# EAGLE design ASM2001 (EAGLE 6.3)
DATABASE: ./../../../../../Components/TinyCircuits_Part_Database.txt
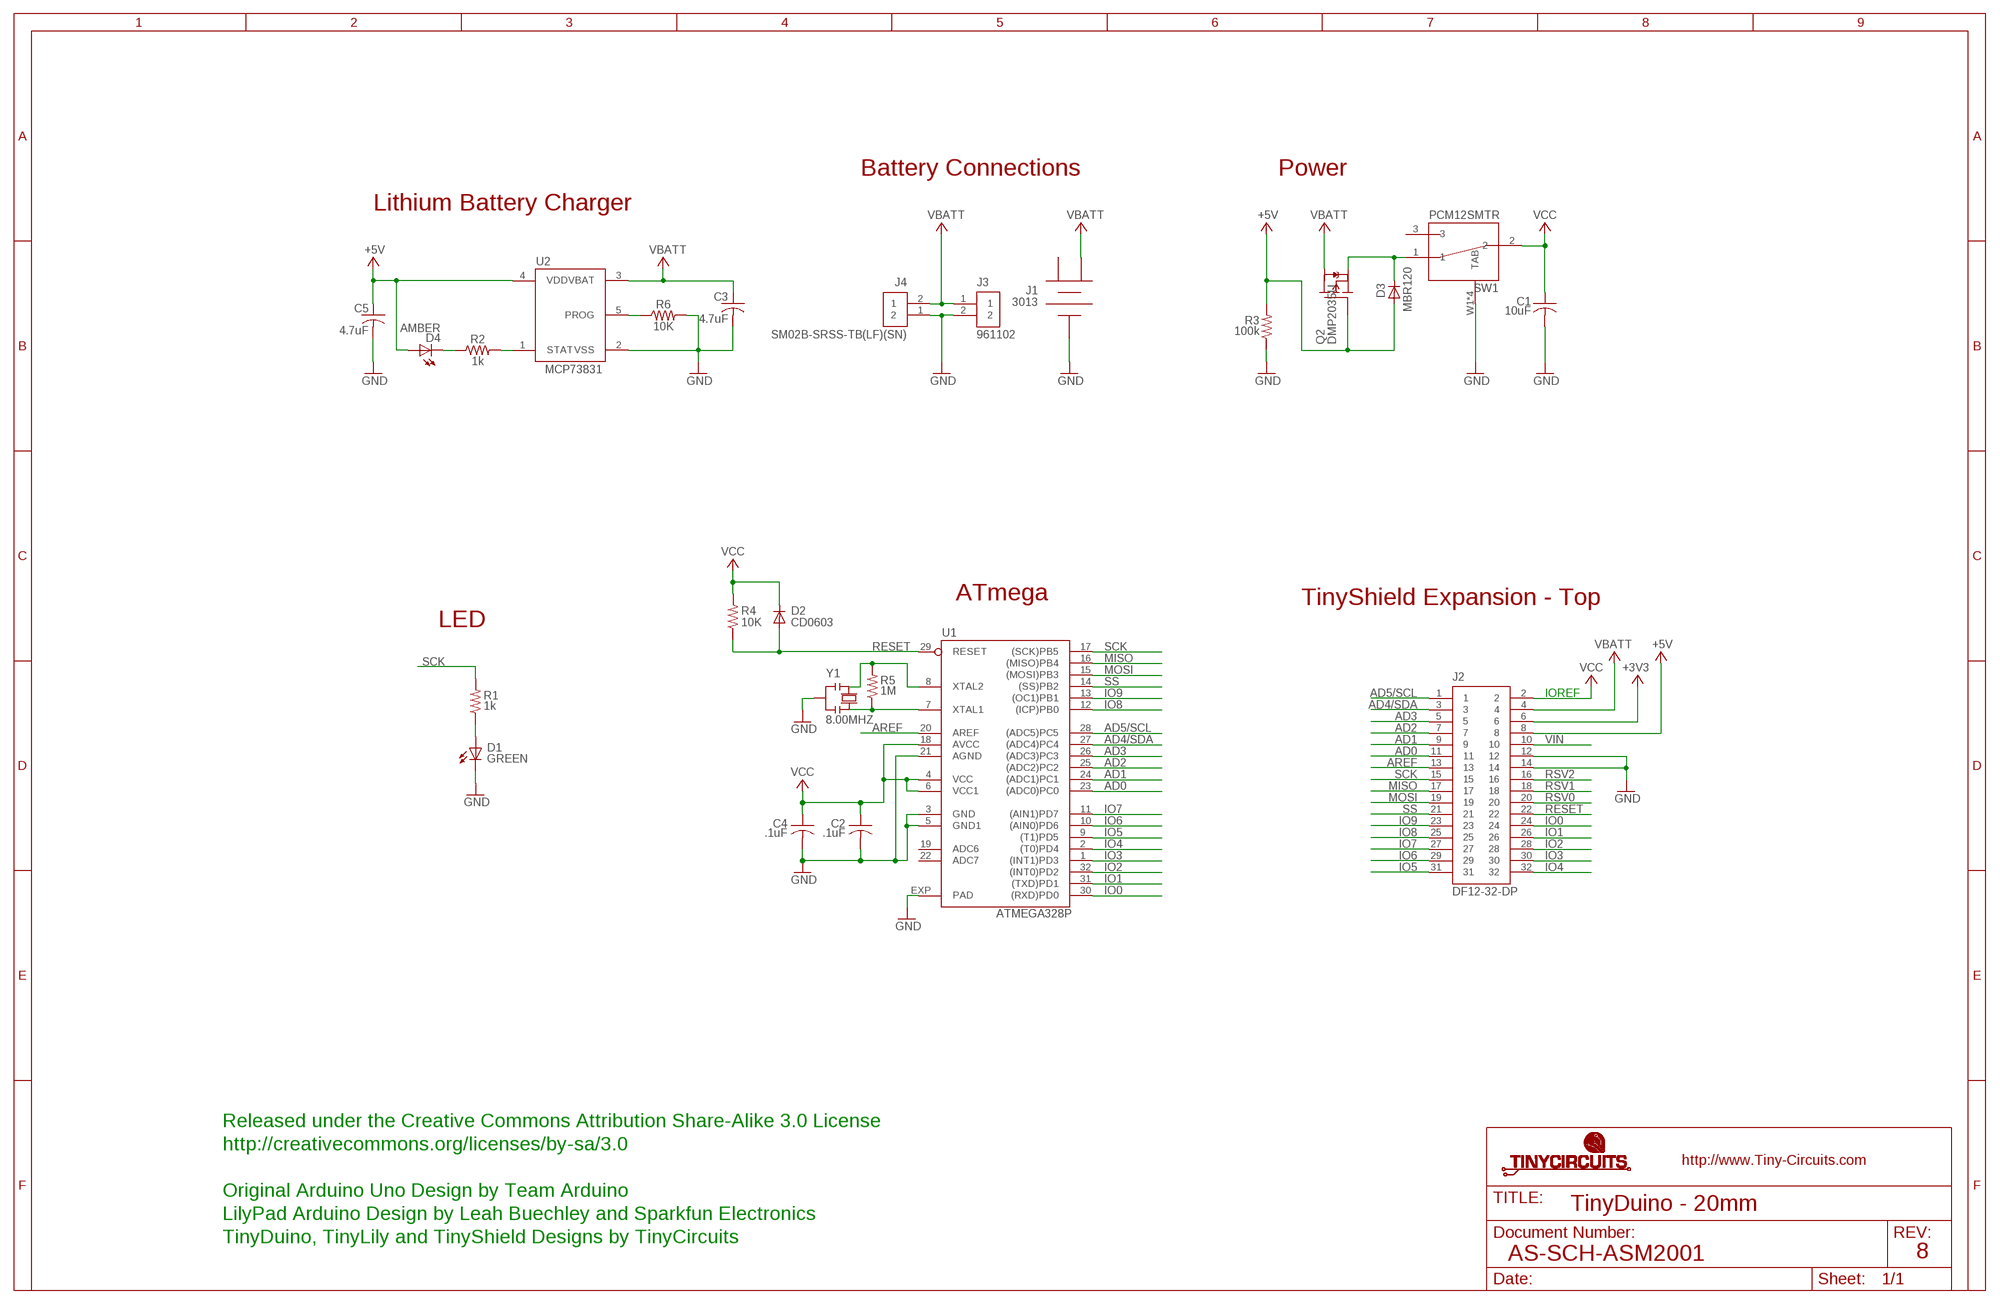
[diagram p0: schematic, sheet 1]

## Parts
C1  10uF  AS-ITM-00002  [C0603]
C2  .1uF  AS-ITM-00008  [C0402]
C3  4.7uF  AS-ITM-00242  [C0402]
C4  .1uF  AS-ITM-00008  [C0402]
C5  4.7uF  AS-ITM-00242  [C0402]
D1  GREEN  AS-ITM-00011  [LNJ_LED]
D2  CD0603  AS-ITM-00009  [0603]
D3  MBR120  AS-ITM-00111  [SOD-123FL]
D4  AMBER  AS-ITM-00026  [LNJ_LED]
J1  3013  AS-ITM-00001  [3013]
J2  DF12-32-DP  AS-ITM-00015  [DF12-32-DP]
J3  961102  AS-ITM-00044  [2X.1"]
J4  SM02B-SRSS-TB(LF)(SN)  AS-ITM-00231  [JST_SH_2X1]
Q2  DMP2035U  AS-ITM-00024  [SOT23]
R1  1k  AS-ITM-00003  [0402]
R2  1k  AS-ITM-00003  [0402]
R3  100k  AS-ITM-00004  [0402]
R4  10K  AS-ITM-00032  [0402]
R5  1M  AS-ITM-00005  [0402]
R6  10K  AS-ITM-00032  [0402]
SW1  PCM12SMTR  AS-ITM-00220  [PCM12SMTR]
U1  ATMEGA328P  AS-ITM-00013MU  [ATMEL_QFN32]
U2  MCP73831  AS-ITM-00136  [SOT-23]
Y1  8.00MHZ  AS-ITM-00027B  [RESONATOR_SMALL]

## Nets
+3V3: J2.6
+5V: C5.1 D3.A D4.A J2.8 Q2.B(G) R3.2 U2.4(VDD)
AD0: J2.11 U1.23((ADC0)PC0)
AD1: J2.9 U1.24((ADC1)PC1)
AD2: J2.7 U1.25((ADC2)PC2)
AD3: J2.5 U1.26((ADC3)PC3)
AD4/SDA: J2.3 U1.27((ADC4)PC4)
AD5/SCL: J2.1 U1.28((ADC5)PC5)
AREF: J2.13 U1.20(AREF)
GND: C1.2 C2.2 C3.2 C4.2 C5.2 D1.C J1.3 J2.12 J2.14 J3.2 J4.1 R3.1 R6.2 SW1.W1(TAB) SW1.W2(TAB) SW1.W3(TAB) SW1.W4(TAB) U1.3(GND) U1.5(GND1) U1.21(AGND) U1.EXP(PAD) U2.2(VSS) Y1.2
IO0: J2.24 U1.30((RXD)PD0)
IO1: J2.26 U1.31((TXD)PD1)
IO2: J2.28 U1.32((INT0)PD2)
IO3: J2.30 U1.1((INT1)PD3)
IO4: J2.32 U1.2((T0)PD4)
IO5: J2.31 U1.9((T1)PD5)
IO6: J2.29 U1.10((AIN0)PD6)
IO7: J2.27 U1.11((AIN1)PD7)
IO8: J2.25 U1.12((ICP)PB0)
IO9: J2.23 U1.13((OC1)PB1)
MISO: J2.17 U1.16((MISO)PB4)
MOSI: J2.19 U1.15((MOSI)PB3)
N$1: R5.2 U1.8(XTAL2) Y1.1
N$2: D3.C Q2.E(S) SW1.1
N$3: R5.1 U1.7(XTAL1) Y1.3
N$4: D1.A R1.1
N$5: D4.C R2.1
N$6: R6.1 U2.5(PROG)
N$7: R2.2 U2.1(STAT)
RESET: D2.A J2.22 R4.1 U1.29(RESET)
RSV0: J2.20
RSV1: J2.18
RSV2: J2.16
SCK: J2.15 R1.2 U1.17((SCK)PB5)
SS: J2.21 U1.14((SS)PB2)
VBATT: C3.1 J1.2 J2.4 J3.1 J4.2 Q2.C(D) U2.3(VBAT)
VCC: C1.1 C2.1 C4.1 D2.C J2.2 R4.2 SW1.2 U1.4(VCC) U1.6(VCC1) U1.18(AVCC)
VIN: J2.10
Unconnected: SW1.3 U1.19(ADC6) U1.22(ADC7)

## Notes on the sheet
- Battery Connections | Power
- Lithium Battery Charger
- ATmega | TinyShield Expansion - Top
- LED
- IOREF
- Released under the Creative Commons Attribution Share-Alike 3.0 License
- http://creativecommons.org/licenses/by-sa/3.0
- Original Arduino Uno Design by Team Arduino
- TinyDuino - 20mm
- LilyPad Arduino Design by Leah Buechley and Sparkfun Electronics
- TinyDuino, TinyLily and TinyShield Designs by TinyCircuits
- AS-SCH-ASM2001 | 8

## Power pins joined to a net without a drawn wire
1: J1.1

## Library data of the parts
C1 = tinycircuits:AS-ITM-00002: CAP CER 10UF 10V 20% X5R 0603; PARTNO: AS-ITM-00002
C2 C4 = tinycircuits:AS-ITM-00008: CAP CER 0.1UF 16V 10% X5R 0402; PARTNO: AS-ITM-00008; VALUE: 0.1uF
C3 C5 = tinycircuits:AS-ITM-00242: CAP CER 4.7UF 6.3V 20% X5R 0402; PARTNO: AS-ITM-00242
D1 = tinycircuits:AS-ITM-00011: LED GREEN SIDE VIEW SMD; PARTNO: AS-ITM-00011
D2 = tinycircuits:AS-ITM-00009: Diodes (General Purpose, Power, Switching) IO=150mA VR=75V HIGH SPEED; PARTNO: AS-ITM-00009
D3 = tinycircuits:AS-ITM-00111: DIODE SCHOTTKY 20V 1A SOD123L; PARTNO: AS-ITM-00111; VALUE: MBR120VLSFT1G
D4 = tinycircuits:AS-ITM-00026: LED AMBER SIDE VIEW SMD; PARTNO: AS-ITM-00026
J1 = tinycircuits:AS-ITM-00001: Keystone 3013 - RETAINER COIN CELL 16MM PC T/H; PARTNO: AS-ITM-00001
J2 = tinycircuits:AS-ITM-00015: CONN HEADER 32POS 3MM SMD 0.5MM; PARTNO: AS-ITM-00015
J3 = tinycircuits:AS-ITM-00044: CONN HEADER R/A SGL 2POS GOLD; PARTNO: AS-ITM-00044
J4 = tinycircuits:AS-ITM-00231: CONN HEADER SH 2POS SIDE 1MM; PARTNO: AS-ITM-00231
Q2 = tinycircuits:AS-ITM-00024: P-Channel MOSFET SOT-23; PARTNO: AS-ITM-00024
R1 R2 = tinycircuits:AS-ITM-00003: RES 1.00K OHM 1/16W 1% 0402; PARTNO: AS-ITM-00003; VALUE: 1.00K
R3 = tinycircuits:AS-ITM-00004: RES 100K OHM 1/16W 1% 0402; PARTNO: AS-ITM-00004; VALUE: 100K
R4 R6 = tinycircuits:AS-ITM-00032: RES 10.0K OHM 1/16W 1% 0402 SMD; PARTNO: AS-ITM-00032; VALUE: 10.0K
R5 = tinycircuits:AS-ITM-00005: RES 1.00M OHM 1/16W 1% 0402; PARTNO: AS-ITM-00005; VALUE: 1.00M
SW1 = tinycircuits:AS-ITM-00220: SW SLIDE SP2T 6VDC 0.3A SMT; PARTNO: AS-ITM-00220
U1 = tinycircuits:AS-ITM-00013: MCU AVR 32K FLASH 32-QFN; PARTNO: AS-ITM-00013; VALUE: ATMEGA328P-MU
U2 = tinycircuits:AS-ITM-00136: IC CONTROLLER LI-ION 4.2V SOT23-5; PARTNO: AS-ITM-00136
Y1 = tinycircuits:AS-ITM-00027: CER RESONATOR 8.00MHZ SMD; PARTNO: AS-ITM-00027

## Board
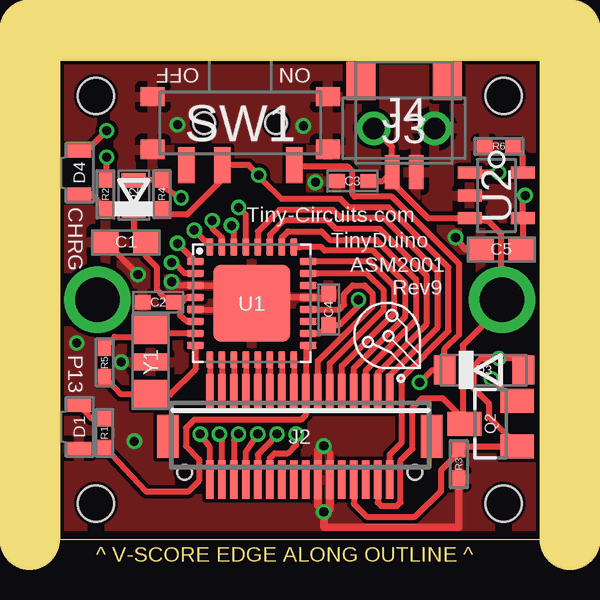
[diagram p1: board, top side]
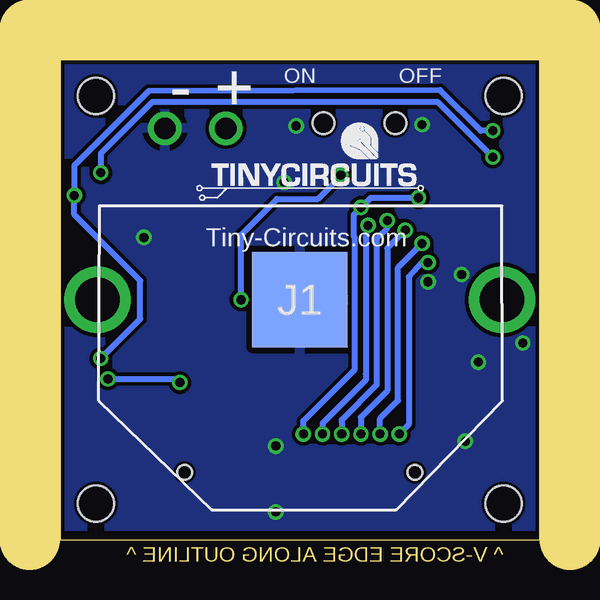
[diagram p2: board, bottom side, seen from below]

Size 20 x 20 mm. Coordinates in mm from the lower left corner, seen from the top.
Outline: 0,20 20,20 20,0 0,0 0,20
Copper layers (1*16): Top 0.035mm / dielectric 1.5mm / Bottom 0.035mm
Design rules "default *": minimum track width 8mil, minimum drill 15mil, track to track 6mil, track to pad 6mil, pad to pad 6mil, via to via 6mil, smd to smd 6mil, copper to edge 6mil, drill to drill 8mil, minimum pad ring 8mil, minimum via ring 5mil, stop-mask expansion 4mil, vias tented up to drill 25mil, thermal gap 10mil
Holes 1.5 mm at 1.5,18.5 18.5,18.5 1.5,1.5 18.5,1.5
tRestrict: 1 lines
bRestrict: 1 lines
Milling: 3 lines

### Footprints (pad centres in the part's own frame; a part is rotated, then mirrored left to right if it is on the bottom)
C0603 = smd 1.1 x 1: 1 -0.85,0; 2 0.85,0
C0402 = smd 0.65 x 0.6: 1 -0.65,0; 2 0.65,0
LNJ_LED = smd 1 x 0.55: A 0,0.9; C 0,-0.9
0603 = smd 0.61 x 0.991: A 0.622,0; C -0.622,0
SOD-123FL = smd 0.914 x 1.219: A 1.638,0; C -1.638,0
3013 = drill 1.854: 1 8.433,0; 2 -8.433,0 | smd 3.962 x 3.962: 3 0,0
DF12-32-DP = smd 0.3 x 1.6: 1 -3.75,-1.8; 2 -3.75,1.8; 3 -3.25,-1.8; 4 -3.25,1.8; 5 -2.75,-1.8; 6 -2.75,1.8; 7 -2.25,-1.8; 8 -2.25,1.8; 9 -1.75,-1.8; 10 -1.75,1.8; 11 -1.25,-1.8; 12 -1.25,1.8; 13 -0.75,-1.8; 14 -0.75,1.8; 15 -0.25,-1.8; 16 -0.25,1.8; 17 0.25,-1.8; 18 0.25,1.8; 19 0.75,-1.8; 20 0.75,1.8; 21 1.25,-1.8; 22 1.25,1.8; 23 1.75,-1.8; 24 1.75,1.8; 25 2.25,-1.8; 26 2.25,1.8; 27 2.75,-1.8; 28 2.75,1.8; 29 3.25,-1.8; 30 3.25,1.8; 31 3.75,-1.8; 32 3.75,1.8 | smd 0.9 x 1.8: F1 -5.5,0; F2 5.5,0 | hole 0.6: -4.8,1.5; 4.8,1.5
2X.1" = drill 0.889 pad 1.397: 1 -1.27,0; 2 1.27,0
JST_SH_2X1 = smd 0.6 x 1.4: 1 -0.5,2.475; 2 0.5,2.475 | smd 1.2 x 1.6: PAD1 -1.8,-1.325; PAD2 1.8,-1.325
SOT23 = smd 1 x 1.4: B -0.95,-1.1; C 0,1.1; E 0.95,-1.1
0402 = smd 0.65 x 0.55: 1 -0.6,0; 2 0.6,0
PCM12SMTR = smd 0.7 x 1.5: 1 -2.25,1.75; 2 0.75,1.75; 3 2.25,1.75 | smd 1 x 0.8: W1 -3.65,1.1; W2 -3.65,-1.1; W3 3.65,-1.1; W4 3.65,1.1 | hole 0.9: 1.5,0; -1.5,0
ATMEL_QFN32 = smd 0.711 x 0.305: 1 -2.351,1.75; 2 -2.351,1.25; 3 -2.351,0.75; 4 -2.351,0.25; 5 -2.351,-0.25; 6 -2.351,-0.75; 7 -2.351,-1.25; 8 -2.351,-1.75; 17 2.351,-1.75; 18 2.351,-1.25; 19 2.351,-0.75; 20 2.351,-0.25; 21 2.351,0.25; 22 2.351,0.75; 23 2.351,1.25; 24 2.351,1.75 | smd 0.305 x 0.711: 9 -1.75,-2.351; 10 -1.25,-2.351; 11 -0.75,-2.351; 12 -0.25,-2.351; 13 0.25,-2.351; 14 0.75,-2.351; 15 1.25,-2.351; 16 1.75,-2.351; 25 1.75,2.351; 26 1.25,2.351; 27 0.75,2.351; 28 0.25,2.351; 29 -0.25,2.351; 30 -0.75,2.351; 31 -1.25,2.351; 32 -1.75,2.351 | smd 3.2 x 3.2: EXP 0,0
SOT-23 = smd 0.5 x 1: 1 -0.95,-1.1; 2 0,-1.1; 3 0.95,-1.1; 4 0.95,1.1; 5 -0.95,1.1
RESONATOR_SMALL = smd 1.2 x 1.5: 1 -1.35,0; 3 1.35,0 | smd 0.7 x 1.5: 2 0,0

### Placement (x,y rotation side)
C1  2.75,12.4 180 top
C2  4.1,9.9 180 top
C3  12.2,14.95 180 top
C4  11.2,9.6 90 top
C5  10uF  [C0603]  18.4,12.1 180 top
D1  0.8,4.7 0 top
D2  3.08,14.35 90 top
D3  17.68,7.07 0 top
D4  0.8,15.3 0 top
J1  10,10 0 bottom
J2  10,4.3 180 top
J3  14.35,17.15 0 top
J4  14.35,17.8 180 top
Q2  17.96,4.83 90 top
R1  1.86,4.44 270 top
R2  1.9,14.4 90 top
R3  16.64,3.15 90 top
R4  4.25,14.4 270 top
R5  1.86,7.38 270 top
R6  18.3,16.4 180 top
SW1  7.52,17.37 180 top
U1  8,9.85 0 top
U2  18.2,14.35 270 top
U$1  [DOCFIELD-TINYCIRCUITS-PCB]  34,-10 0 top  (outside the outline)
Y1  3.77,7.41 90 top

### Tracks (layer width: path | path; a pad name or v marks a point on that pad's centre or on a via)
+5V  (via drill 0.38)
  Top 0.254: D3.A 19.39,7.55 v18.3,7.55 17.55,7.55 17.25,7.25 17.25,6.3 17.9,5.65 17.9,5.09 Q2.B 16.77,3.88 R3.2 | v19.4,14.35 19.3,14.25 U2.4 19.3,12.45 C5.1 | J2.8 12.25,1.5 12.8,0.95 14.81,0.95 15.9,2.04 15.9,2.9 16.64,3.64 R3.2 | 16.49,3.74 R3.2 | D4.A 1.1,16.2 v1.95,17.05
  Bottom 0.254: v18.3,7.55 16.65,9.2 16.65,10.8 19.4,13.55 v19.4,14.35 19.4,15.6 16.3,18.7 4.15,18.75 2.45,17.05 v1.95,17.05
AD0
  Top 0.254: 10.75,11.1 U1.23 12.8,11.1 13.5,10.4 13.5,9.6 11.25,7.35 J2.11
AD1
  Top 0.254: J2.9 11.75,7.25 13.95,9.45 13.95,10.55 12.9,11.6 U1.24
AD2
  Top 0.254: J2.7 12.25,7.15 14.4,9.3 14.4,10.7 13.05,12.05 11.05,12.05 10.9,12.2 10.05,12.2 U1.25
AD3
  Top 0.254: J2.5 12.75,7.05 14.85,9.15 14.85,10.85 13.2,12.5 11.25,12.5 10.9,12.85 9.5,12.85 9.25,12.6 U1.26
AD4/SDA
  Top 0.254: J2.3 13.25,6.95 15.3,9 15.3,11 13.35,12.95 11.5,12.95 11.15,13.3 9.35,13.3 8.75,12.7 U1.27
AD5/SCL
  Top 0.254: U1.28 8.25,12.85 9.15,13.75 11.4,13.75 11.75,13.4 13.5,13.4 15.75,11.15 15.75,8.85 13.75,6.85 J2.1
AREF
  Top 0.254: U1.20 11.65,9.6 11.85,9.8 11.85,10.25 12.2,10.6 12.7,10.6 13.05,10.25 13.05,9.75 10.75,7.45 J2.13
GND  (via drill 0.38)
  Top 0.254: 11.25,1.45 11.25,1.3 11.3,1.25 | U1.EXP 8,10.6 U1.3 4.8,10.6 v4.65,10.75 | U1.5 8,9.55 U1.EXP | U1.21 8.25,10.1 U1.EXP | U1.21 11.1,10.1 C4.2 11.05,10.1 U1.21 | C5.2 16.9,12.1 v16.5,12.6 | 11.25,2.05 J2.12 11.25,3.65 | v3.25,11.05 C1.2
  Top 0.305: 11.25,2.05 11.25,1.45 | 10.75,3.75 10.75,1.4 v11,1.15 | v11,1.15 11.1,1.15 11.25,1.3 | v11,1.15 11,0.51 16.64,0.51 R3.1
  Bottom 0.254: J1.3 10.25,10 U1.21
  other vias: 2.55,7.4 11,3.9 0.7,8.2 10.15,17.25 4.9,17.3 3.1,4.1 10.65,14.9
  pour Top: 0,20 20,20 20,0 0,0
  pour Bottom: 0,20 20,20 20,0 0,0
IO0  (via drill 0.38)
  Top 0.254: v9.05,4.4 8.75,4.05 8.25,3.55 J2.24 | U1.30 7.25,12.9 v7.15,13.1
  Bottom 0.254: v9.05,4.4 9.05,4.85 7.25,6.65 7.25,6.9 7.25,12.6 v7.15,13.1
IO1  (via drill 0.38)
  Top 0.254: J2.26 7.75,3.65 v8.25,4.4 | U1.31 6.75,12.6 6.35,13 v6.35,13.3
  Bottom 0.254: v8.25,4.4 8.25,4.9 8.25,4.95 8.25,5 6.8,6.45 6.8,12.55 6.35,13 v6.35,13.3
IO2  (via drill 0.38)
  Top 0.254: v7.45,4.4 7.25,4.15 J2.28 | U1.32 6.25,12.25 v5.6,12.9
  Bottom 0.254: v7.45,4.4 7.45,4.55 7.45,5.1 6.35,6.2 6.35,12.15 v5.6,12.9
IO3  (via drill 0.38)
  Top 0.254: J2.30 6.75,4.3 v6.65,4.4 | U1.1 5.45,11.8 v4.9,12.35
  Bottom 0.254: v6.65,4.4 6.65,5.05 5.9,5.8 5.9,11.35 v4.9,12.35
IO4  (via drill 0.38)
  Top 0.254: J2.32 6.25,3.85 v5.85,4.4 | U1.2 5.2,11.1 4.75,11.55 v4.65,11.55
  Bottom 0.254: v5.85,4.4 5.45,4.8 5.45,10.95 4.9,11.55 v4.65,11.55
IO5
  Top 0.254: U1.9 J2.31
IO6
  Top 0.254: U1.10 J2.29
IO7
  Top 0.254: U1.11 J2.27
IO8
  Top 0.254: U1.12 J2.25
IO9
  Top 0.254: U1.13 J2.23
MISO
  Top 0.254: U1.16 J2.17
MOSI
  Top 0.254: U1.15 J2.19
N$1
  Top 0.254: U1.8 5.65,7.1 4.6,6.05 Y1.1 2.54,6.05 R5.2
N$2  (via drill 0.38)
  Top 0.254: Q2.E 18.92,5.78 v18,6.7 | v15,6.55 15.52,7.07 D3.C 16.04,7.94 16.65,8.55 16.65,11.5 13.85,14.3 12.3,14.3 12.2,14.4 12.2,15.35 12,15.55 9.84,15.55 SW1.1
  Bottom 0.254: v18,6.7 15.15,6.7 v15,6.55
N$3
  Top 0.254: U1.7 3.93,8.6 Y1.3 3.4,8.75 3.1,8.45 2.28,8.45 R5.1
N$4
  Top 0.254: R1.1 1.33,5.04 D1.A
N$5
  Top 0.254: D4.C 1.3,14.4 R2.1
N$6
  Top 0.254: U2.5 19.3,16 R6.1
N$7  (via drill 0.38)
  Top 0.254: R2.2 1.95,15.05 v1.95,15.95 | v18.3,15.3 U2.1
  Bottom 0.254: v1.95,15.95 4.25,18.25 16.15,18.25 18.3,16.1 v18.3,15.3
RESET  (via drill 0.38)
  Top 0.254: U1.29 7.75,13.55 v7.45,13.85 | J2.22 8.75,3.4 8.95,3.6 9.5,3.6 9.85,3.95 v9.85,4.4 | 2.87,15.02 D2.A 3.1,15 R4.1 4.25,14.75 v5.05,14.25
  Bottom 0.254: v9.85,4.4 9.85,4.95 7.7,7.1 7.7,12.6 7.75,12.65 7.75,13.55 v7.45,13.85 7.05,14.25 v5.05,14.25
SCK
  Top 0.254: U1.17 10.25,8 J2.15 10.25,5.2 10.05,5 5.6,5 5.25,4.65 5.25,3.9 5.8,3.35 5.8,2.45 5.35,2 3.6,2 R1.2
SS
  Top 0.254: U1.14 J2.21
VBATT
  Top 0.254: J4.2 14.05,14.7 15.35,13.4 U2.3 17.9,13.25 18.4,12.75 18.4,10.13 J1.2 18.45,9.98 18.45,9.75 16.8,8.1 16.8,4.89 Q2.C 16.86,4.99 15.95,5.9 15.1,5.9 14.7,5.5 14.7,3.8 14.2,3.3 14.2,1.55 14.05,1.4 13.4,1.4 13.25,1.55 J2.4 | J4.2 13.85,16.38 J3.1 | C3.1 13.48,14.95 J4.2
VCC  (via drill 0.38)
  Top 0.254: U1.4 5.3,10.1 5,9.85 | 5,9.85 5,9.35 5.3,9.1 U1.6 | U1.18 10.85,8.6 C4.1 11.65,8.95 12.45,9.75 v12.45,10 | 5,9.85 4.8,9.9 C2.1 4.5,9.9 4.04,10.41 4.05,11.35 3.59,11.81 C1.1 | J2.2 13.75,3.55 14.25,4.05 14.25,6.75 16.2,8.7 16.2,11.35 13.7,13.85 12.05,13.85 11.7,14.2 9.25,14.2 8.45,15 v8.29,15.2 7.87,15.62 SW1.2 6.77,15.02 5.3,13.55 4.5,13.55 R4.2 3.15,13.8 D2.C | 3.9,12.25 C1.1 | D2.C 2.78,13.76 | D2.C 3.08,12.92 C1.1
  Bottom 0.254: v12.45,10 12.45,12.7 10.95,14.2 9.25,14.2 8.45,15 v8.29,15.2

### Text on the board
Dimension: ^ V-SCORE EDGE ALONG OUTLINE ^
tPlace: OFF | ON | CHRG | Tiny-Circuits.com | TinyDuino | ASM2001 | Rev9 | P13
bPlace: OFF | ON | + | - | Tiny-Circuits.com
Document: FABRICATION DRAWING | NOTES: | 1. PRINTED CIRCUIT BOARD MADE FROM NEMA GRADE FR-4 EPOXY LAMINATE | WITH 1 OUNCE COPPER PLATING AND .024 THICKNESS. | 2. ALL DIMENSIONS ARE GIVEN IN INCHES. | 3. CIRCUIT PATHS ARE FOR REFERENCE ONLY. | 4. HOLE SIZES SHOWN ARE FINISHED DIAMETERS AFTER PLATING. | 5. BOARD PLATED USING REFLOW OR SIMILAR METHOD. | 6. BOARD TO HAVE BLUE SOLDER MASK ON PLATED SURFACES USING WET FILM | 7. SILKSCREEN BOARD USING WHITE INK. | SR100 OR SR1010 EPOXY. EQUIVALENT WET OR DRY FILM MAY BE USED. | 8. THE FOLLOWING INFORMATION APPLIES TO THIS BOARD: | * 2 COPPER LAYERS | * .024 BOARD THICKNESS | * REQUIRES TOP SIDE SILKSCREEN | Released under the Creative Commons Attribution Share-Alike 3.0 License | http://creativecommons.org/licenses/by-sa/3.0 | LilyPad Arduino Design by Leah Buechley and Sparkfun Electronics | Original Arduino Uno Design by Team Arduino | TinyDuino, TinyLily and TinyShield Designs by TinyCircuits | TinyDuino - 20mm | AS-PCB-ASM2001 | 9